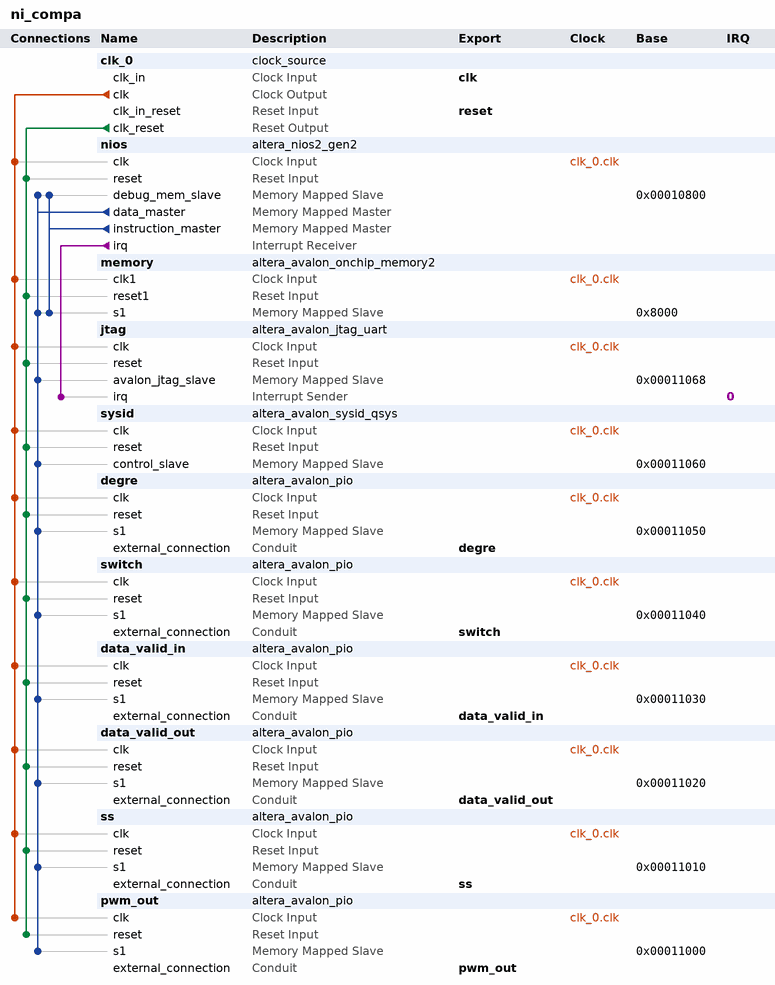
[diagram p0: system contents]
# Platform Designer (Qsys) system ni_compa, Cyclone IV E EP4CE22F17C6
# Parameters at their usual value, and those the tool derives, are not listed.
package require -exact qsys 18.1
create_system ni_compa
set_project_property DEVICE_FAMILY {Cyclone IV E}
set_project_property DEVICE EP4CE22F17C6

add_instance clk_0 clock_source 18.1
set_instance_parameter_value clk_0 clockFrequency 50000000

add_instance nios altera_nios2_gen2 18.1
set_instance_parameter_value nios dcache_size 2048
set_instance_parameter_value nios exceptionSlave memory.s1
set_instance_parameter_value nios icache_size 4096
set_instance_parameter_value nios impl Tiny
set_instance_parameter_value nios resetSlave memory.s1

add_instance memory altera_avalon_onchip_memory2 18.1
set_instance_parameter_value memory dataWidth 32
set_instance_parameter_value memory dualPort false
set_instance_parameter_value memory initMemContent true
set_instance_parameter_value memory initializationFileName onchip_mem.hex
set_instance_parameter_value memory memorySize 20000

add_instance jtag altera_avalon_jtag_uart 18.1
set_instance_parameter_value jtag simInteractiveOptions NO_INTERACTIVE_WINDOWS

add_instance sysid altera_avalon_sysid_qsys 18.1
set_instance_parameter_value sysid id 0

add_instance degre altera_avalon_pio 18.1
set_instance_parameter_value degre direction Input
set_instance_parameter_value degre width 9

add_instance switch altera_avalon_pio 18.1
set_instance_parameter_value switch direction Input
set_instance_parameter_value switch width 4

add_instance data_valid_in altera_avalon_pio 18.1
set_instance_parameter_value data_valid_in direction Input
set_instance_parameter_value data_valid_in width 1

add_instance data_valid_out altera_avalon_pio 18.1
set_instance_parameter_value data_valid_out direction Output
set_instance_parameter_value data_valid_out width 1

add_instance ss altera_avalon_pio 18.1
set_instance_parameter_value ss direction Output
set_instance_parameter_value ss width 1

add_instance pwm_out altera_avalon_pio 18.1
set_instance_parameter_value pwm_out direction Output
set_instance_parameter_value pwm_out width 8

# connections
add_connection clk_0.clk data_valid_in.clk clock
add_connection clk_0.clk data_valid_out.clk clock
add_connection clk_0.clk degre.clk clock
add_connection clk_0.clk jtag.clk clock
add_connection clk_0.clk memory.clk1 clock
add_connection clk_0.clk nios.clk clock
add_connection clk_0.clk pwm_out.clk clock
add_connection clk_0.clk ss.clk clock
add_connection clk_0.clk switch.clk clock
add_connection clk_0.clk sysid.clk clock
add_connection clk_0.clk_reset data_valid_in.reset reset
add_connection clk_0.clk_reset data_valid_out.reset reset
add_connection clk_0.clk_reset degre.reset reset
add_connection clk_0.clk_reset jtag.reset reset
add_connection clk_0.clk_reset memory.reset1 reset
add_connection clk_0.clk_reset nios.reset reset
add_connection clk_0.clk_reset pwm_out.reset reset
add_connection clk_0.clk_reset ss.reset reset
add_connection clk_0.clk_reset switch.reset reset
add_connection clk_0.clk_reset sysid.reset reset
add_connection nios.data_master data_valid_in.s1 avalon
set_connection_parameter_value nios.data_master/data_valid_in.s1 baseAddress 0x00011030
add_connection nios.data_master data_valid_out.s1 avalon
set_connection_parameter_value nios.data_master/data_valid_out.s1 baseAddress 0x00011020
add_connection nios.data_master degre.s1 avalon
set_connection_parameter_value nios.data_master/degre.s1 baseAddress 0x00011050
add_connection nios.data_master jtag.avalon_jtag_slave avalon
set_connection_parameter_value nios.data_master/jtag.avalon_jtag_slave baseAddress 0x00011068
add_connection nios.data_master memory.s1 avalon
set_connection_parameter_value nios.data_master/memory.s1 baseAddress 0x8000
add_connection nios.data_master nios.debug_mem_slave avalon
set_connection_parameter_value nios.data_master/nios.debug_mem_slave baseAddress 0x00010800
add_connection nios.data_master pwm_out.s1 avalon
set_connection_parameter_value nios.data_master/pwm_out.s1 baseAddress 0x00011000
add_connection nios.data_master ss.s1 avalon
set_connection_parameter_value nios.data_master/ss.s1 baseAddress 0x00011010
add_connection nios.data_master switch.s1 avalon
set_connection_parameter_value nios.data_master/switch.s1 baseAddress 0x00011040
add_connection nios.data_master sysid.control_slave avalon
set_connection_parameter_value nios.data_master/sysid.control_slave baseAddress 0x00011060
add_connection nios.instruction_master memory.s1 avalon
set_connection_parameter_value nios.instruction_master/memory.s1 baseAddress 0x8000
add_connection nios.instruction_master nios.debug_mem_slave avalon
set_connection_parameter_value nios.instruction_master/nios.debug_mem_slave baseAddress 0x00010800
add_connection nios.irq jtag.irq interrupt
set_connection_parameter_value nios.irq/jtag.irq irqNumber 0

# exported interfaces
add_interface clk clock sink
set_interface_property clk EXPORT_OF clk_0.clk_in
add_interface data_valid_in conduit end
set_interface_property data_valid_in EXPORT_OF data_valid_in.external_connection
add_interface data_valid_out conduit end
set_interface_property data_valid_out EXPORT_OF data_valid_out.external_connection
add_interface degre conduit end
set_interface_property degre EXPORT_OF degre.external_connection
add_interface pwm_out conduit end
set_interface_property pwm_out EXPORT_OF pwm_out.external_connection
add_interface reset reset sink
set_interface_property reset EXPORT_OF clk_0.clk_in_reset
add_interface ss conduit end
set_interface_property ss EXPORT_OF ss.external_connection
add_interface switch conduit end
set_interface_property switch EXPORT_OF switch.external_connection

set_interconnect_requirement {$system} qsys_mm.clockCrossingAdapter HANDSHAKE
set_interconnect_requirement {$system} qsys_mm.enableEccProtection FALSE
set_interconnect_requirement {$system} qsys_mm.insertDefaultSlave FALSE
set_interconnect_requirement {$system} qsys_mm.maxAdditionalLatency 1

save_system ni_compa.qsys
